# Altium schematic sheet WR_LINK.SchDoc
size A3 portrait
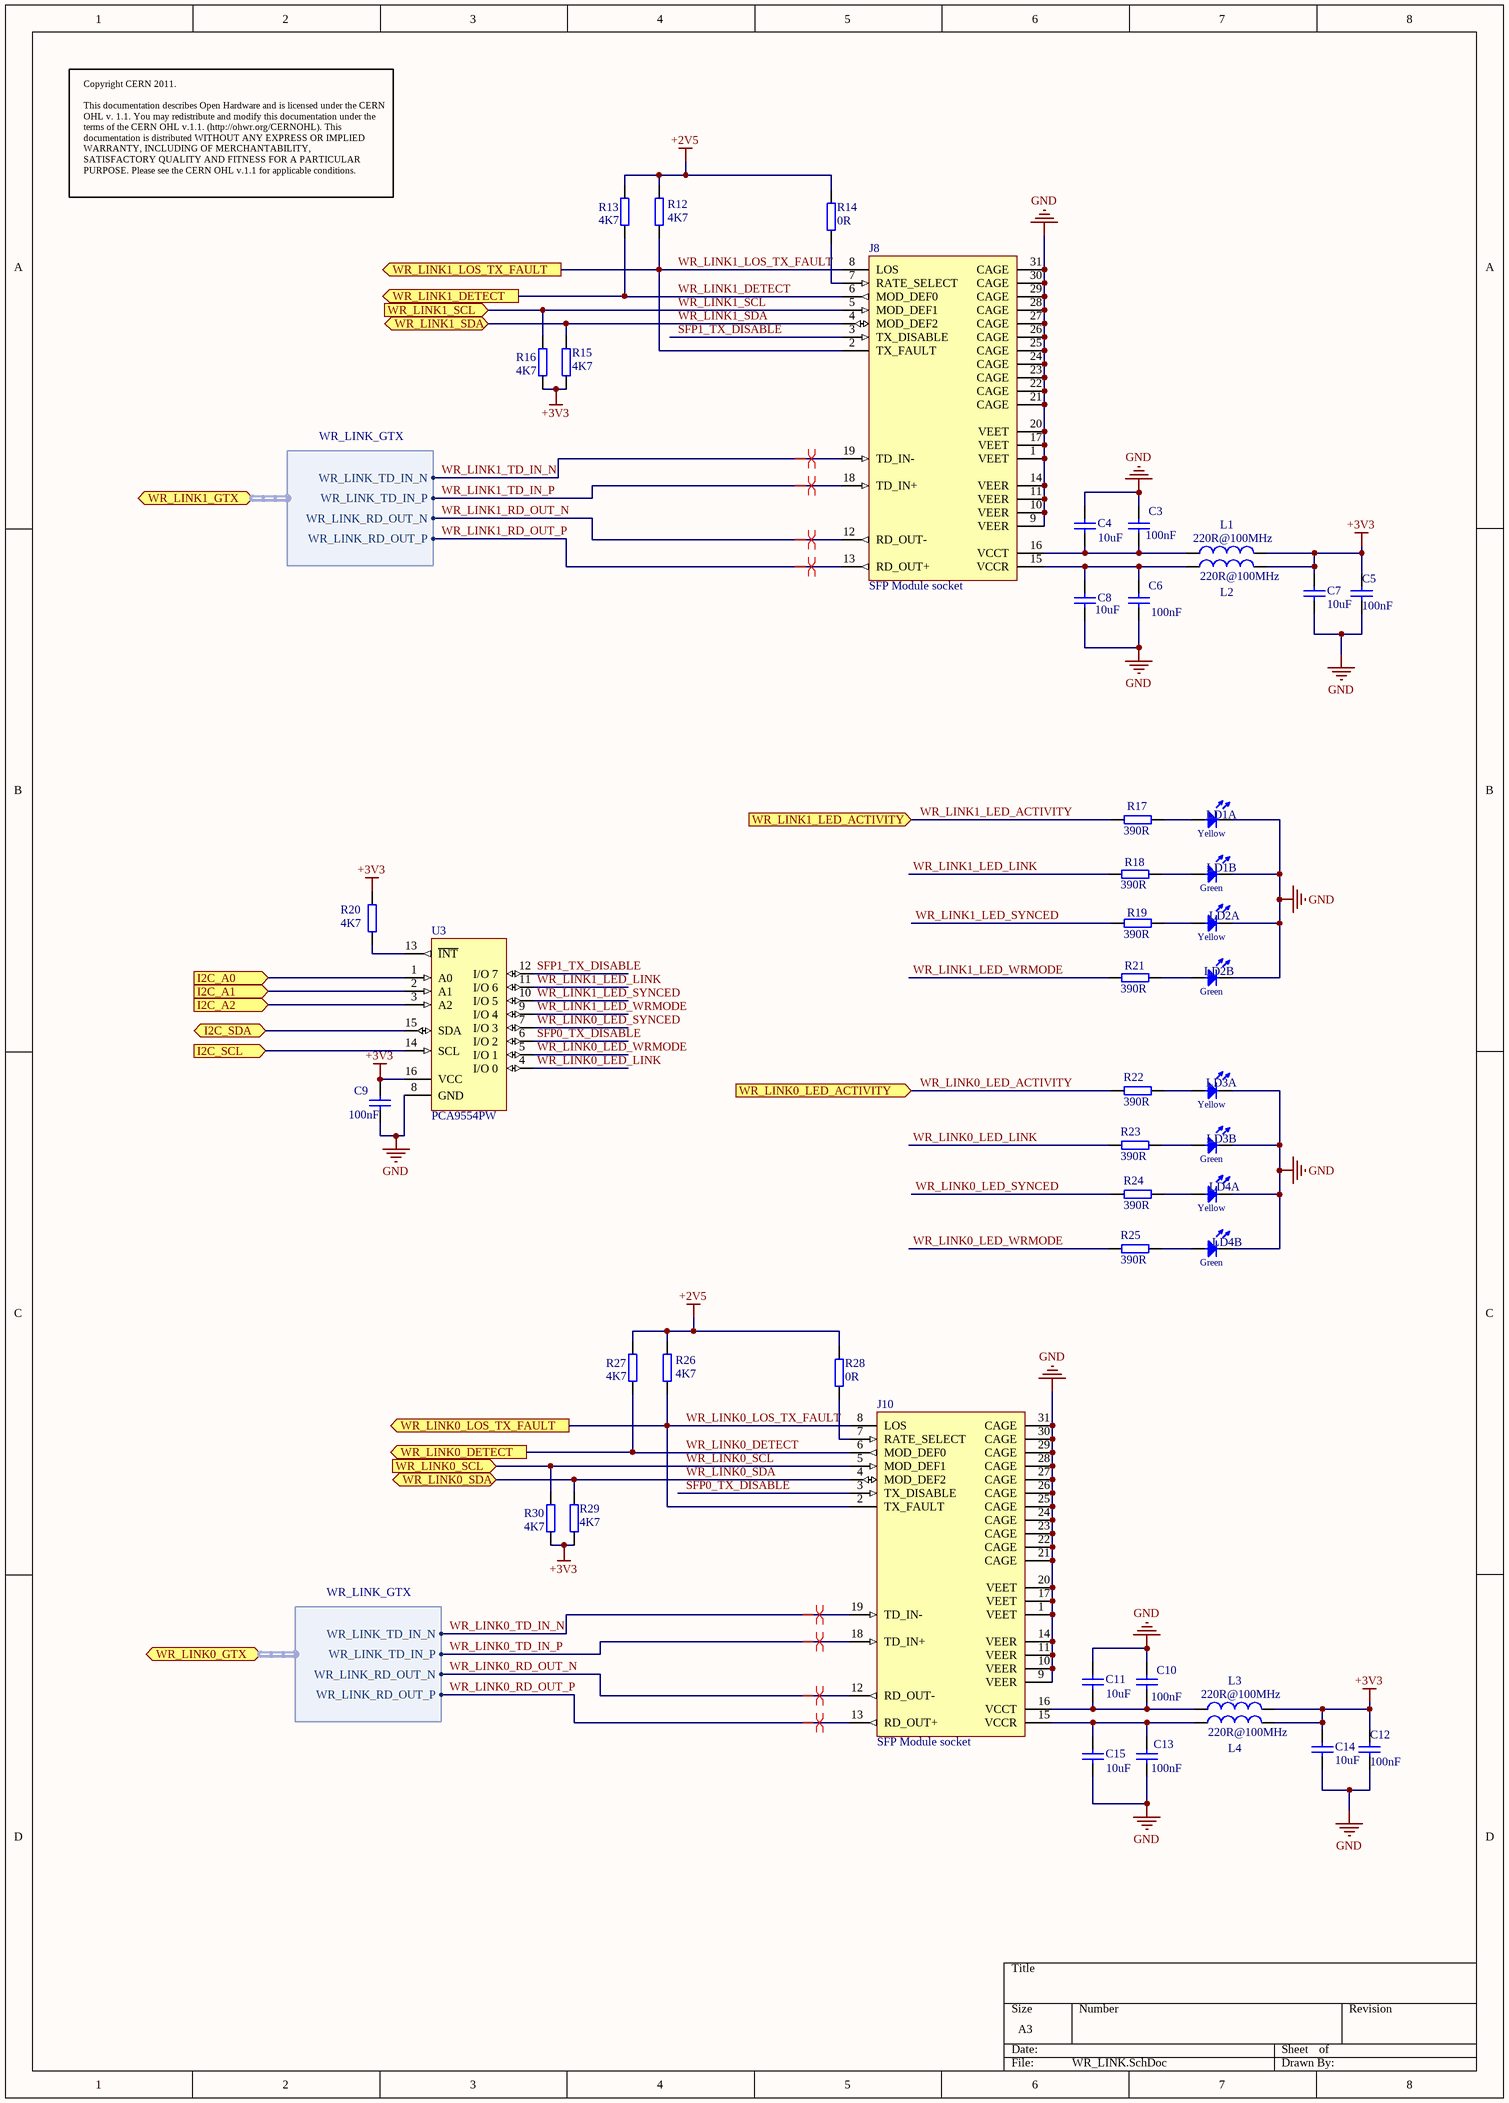
[diagram p0: WR_LINK.SchDoc]

## Parts
C3  100nF  [CC1608-0603]
C4  10uF  [CC2012-0805]
C5  100nF  [CC1608-0603]
C6  100nF  [CC1608-0603]
C7  10uF  [CC1608-0603]
C8  10uF  [CC2012-0805]
C9  100nF  [CC1608-0603]
C10  100nF  [CC1608-0603]
C11  10uF  [CC2012-0805]
C12  100nF  [CC1608-0603]
C13  100nF  [CC1608-0603]
C14  10uF  [CC1608-0603]
C15  10uF  [CC2012-0805]
J8  SFP Module socket  [SFP_SINGLE_PORT]
J10  SFP Module socket  [SFP_SINGLE_PORT]
L1  Impedance: 220R@100MHz  [0603]  (hidden comment: 220R@100MHz Ferrite Bead)
L2  Impedance: 220R@100MHz  [0603]  (hidden comment: 220R@100MHz Ferrite Bead)
L3  Impedance: 220R@100MHz  [0603]  (hidden comment: 220R@100MHz Ferrite Bead)
L4  Impedance: 220R@100MHz  [0603]  (hidden comment: 220R@100MHz Ferrite Bead)
LD1  Green/Yellow  [LED_DIALIGHT_591-3x0x-0xx]  (value not drawn)  (parts A,B of 2)
LD2  Green/Yellow  [LED_DIALIGHT_591-3x0x-0xx]  (value not drawn)  (parts A,B of 2)
LD3  Green/Yellow  [LED_DIALIGHT_591-3x0x-0xx]  (value not drawn)  (parts A,B of 2)
LD4  Green/Yellow  [LED_DIALIGHT_591-3x0x-0xx]  (value not drawn)  (parts A,B of 2)
R12  4K7  [0603]
R13  4K7  [0603]
R14  0R  [0603]
R15  4K7  [0603]
R16  4K7  [0603]
R17  390R  [0603]
R18  390R  [0603]
R19  390R  [0603]
R20  4K7  [0603]
R21  390R  [0603]
R22  390R  [0603]
R23  390R  [0603]
R24  390R  [0603]
R25  390R  [0603]
R26  4K7  [0603]
R27  4K7  [0603]
R28  0R  [0603]
R29  4K7  [0603]
R30  4K7  [0603]
U3  PCA9554PW  [SOP65P640X120-16N]

## Ports
I2C_A0 (in), I2C_A1 (in), I2C_A2 (in), I2C_SCL (in), I2C_SDA (bidir), WR_LINK0_DETECT (out), WR_LINK0_GTX (harness WR_LINK_GTX), WR_LINK0_LED_ACTIVITY (in), WR_LINK0_LOS_TX_FAULT (out), WR_LINK0_SCL (in), WR_LINK0_SDA (bidir), WR_LINK1_DETECT (out), WR_LINK1_GTX (harness WR_LINK_GTX), WR_LINK1_LED_ACTIVITY (in), WR_LINK1_LOS_TX_FAULT (out), WR_LINK1_SCL (in), WR_LINK1_SDA (bidir)

## Harnesses
WR_LINK_GTX: WR_LINK_TD_IN_N, WR_LINK_TD_IN_P, WR_LINK_RD_OUT_N, WR_LINK_RD_OUT_P

## Nets
+2V5: R12.2 R13.2 R14.1 R26.2 R27.2 R28.1
+3V3: C5.1 C7.1 C9.1 C12.1 C14.1 L1.2 L2.2 L3.2 L4.2 R15.2 R16.2 R20.2 R29.2 R30.2 U3.16(VCC)
GND: C3.1 C4.2 C5.2 C6.2 C7.2 C8.1 C9.2 C10.1 C11.2 C12.2 C13.2 C14.2 C15.1 J8.1(VEET) J8.9(VEER) J8.10(VEER) J8.11(VEER) J8.14(VEER) J8.17(VEET) J8.20(VEET) J8.21(CAGE) J8.22(CAGE) J8.23(CAGE) J8.24(CAGE) J8.25(CAGE) J8.26(CAGE) J8.27(CAGE) J8.28(CAGE) J8.29(CAGE) J8.30(CAGE) J8.31(CAGE) J10.1(VEET) J10.9(VEER) J10.10(VEER) J10.11(VEER) J10.14(VEER) J10.17(VEET) J10.20(VEET) J10.21(CAGE) J10.22(CAGE) J10.23(CAGE) J10.24(CAGE) J10.25(CAGE) J10.26(CAGE) J10.27(CAGE) J10.28(CAGE) J10.29(CAGE) J10.30(CAGE) J10.31(CAGE) LD1.1(C) LD1.4(C) LD2.1(C) LD2.4(C) LD3.1(C) LD3.4(C) LD4.1(C) LD4.4(C) U3.8(GND)
I2C_A0: U3.1(A0) ; port I2C_A0
I2C_A1: U3.2(A1) ; port I2C_A1
I2C_A2: U3.3(A2) ; port I2C_A2
I2C_SCL: U3.14(SCL) ; port I2C_SCL
I2C_SDA: U3.15(SDA) ; port I2C_SDA
SFP0_TX_DISABLE: J10.3(TX_DISABLE) U3.6(I/O_2)
SFP1_TX_DISABLE: J8.3(TX_DISABLE) U3.12(I/O_7)
WR_LINK0_DETECT: J10.6(MOD_DEF0) R27.1 ; port WR_LINK0_DETECT
WR_LINK0_LED_ACTIVITY: R22.2 ; port WR_LINK0_LED_ACTIVITY
WR_LINK0_LED_LINK: R23.2 U3.4(I/O_0)
WR_LINK0_LED_SYNCED: R24.2 U3.7(I/O_3)
WR_LINK0_LED_WRMODE: R25.2 U3.5(I/O_1)
WR_LINK0_LOS_TX_FAULT: J10.2(TX_FAULT) J10.8(LOS) R26.1 ; port WR_LINK0_LOS_TX_FAULT
WR_LINK0_RD_OUT_N: J10.12(RD_OUT-) ; port WR_LINK0_GTX.WR_LINK_RD_OUT_N
WR_LINK0_RD_OUT_P: J10.13(RD_OUT+) ; port WR_LINK0_GTX.WR_LINK_RD_OUT_P
WR_LINK0_SCL: J10.5(MOD_DEF1) R30.1 ; port WR_LINK0_SCL
WR_LINK0_SDA: J10.4(MOD_DEF2) R29.1 ; port WR_LINK0_SDA
WR_LINK0_TD_IN_N: J10.19(TD_IN-) ; port WR_LINK0_GTX.WR_LINK_TD_IN_N
WR_LINK0_TD_IN_P: J10.18(TD_IN+) ; port WR_LINK0_GTX.WR_LINK_TD_IN_P
WR_LINK1_DETECT: J8.6(MOD_DEF0) R13.1 ; port WR_LINK1_DETECT
WR_LINK1_LED_ACTIVITY: R17.2 ; port WR_LINK1_LED_ACTIVITY
WR_LINK1_LED_LINK: R18.2 U3.11(I/O_6)
WR_LINK1_LED_SYNCED: R19.2 U3.10(I/O_5)
WR_LINK1_LED_WRMODE: R21.2 U3.9(I/O_4)
WR_LINK1_LOS_TX_FAULT: J8.2(TX_FAULT) J8.8(LOS) R12.1 ; port WR_LINK1_LOS_TX_FAULT
WR_LINK1_RD_OUT_N: J8.12(RD_OUT-) ; port WR_LINK1_GTX.WR_LINK_RD_OUT_N
WR_LINK1_RD_OUT_P: J8.13(RD_OUT+) ; port WR_LINK1_GTX.WR_LINK_RD_OUT_P
WR_LINK1_SCL: J8.5(MOD_DEF1) R16.1 ; port WR_LINK1_SCL
WR_LINK1_SDA: J8.4(MOD_DEF2) R15.1 ; port WR_LINK1_SDA
WR_LINK1_TD_IN_N: J8.19(TD_IN-) ; port WR_LINK1_GTX.WR_LINK_TD_IN_N
WR_LINK1_TD_IN_P: J8.18(TD_IN+) ; port WR_LINK1_GTX.WR_LINK_TD_IN_P
NetC3_2: C3.2 C4.1 J8.16(VCCT) L1.1
NetC6_1: C6.1 C8.2 J8.15(VCCR) L2.1
NetC10_2: C10.2 C11.1 J10.16(VCCT) L3.1
NetC13_1: C13.1 C15.2 J10.15(VCCR) L4.1
NetJ8_7: J8.7(RATE_SELECT) R14.2
NetJ10_7: J10.7(RATE_SELECT) R28.2
NetLD1_2: LD1.2(A) R17.1
NetLD1_3: LD1.3(A) R18.1
NetLD2_2: LD2.2(A) R19.1
NetLD2_3: LD2.3(A) R21.1
NetLD3_2: LD3.2(A) R22.1
NetLD3_3: LD3.3(A) R23.1
NetLD4_2: LD4.2(A) R24.1
NetLD4_3: LD4.3(A) R25.1
NetR20_1: R20.1 U3.13(~{INT})

## Layout directives
differential pair: WR_LINK0_RD_OUT_N, WR_LINK0_RD_OUT_P, WR_LINK0_TD_IN_N, WR_LINK0_TD_IN_P, WR_LINK1_RD_OUT_N, WR_LINK1_RD_OUT_P, WR_LINK1_TD_IN_N, WR_LINK1_TD_IN_P

## Notes on the sheet
- Copyright CERN 2011.
  This documentation describes Open Hardware and is licensed under the CERN OHL v. 1.1. You may redistribute and modify this documentation under the terms of the CERN OHL v.1.1. (http://ohwr.org/CERNOHL). This documentation is distributed WITHOUT ANY EXPRESS OR IMPLIED WARRANTY, INCLUDING OF MERCHANTABILITY, SATISFACTORY QUALITY AND FITNESS FOR A PARTICULAR PURPOSE. Please see the CERN OHL v.1.1 for applicable conditions.
- (in symbol LED_DIALIGHT_591-3x0x, part A) Yellow
- (in symbol LED_DIALIGHT_591-3x0x, part B) Green

## Library data of the parts
C3 C5 C6 C9 C10 C12 C13 = CC0603_100NF_16V_10%_X7R: Capacitor; Manufacturer1: AVX; Manufacturer1 PN: 0603YC104KAT2A; TC: X7R; Tolerance: ±10%; Voltage: 16V; Published: 8-Jun-2000; LatestRevisionDate: 17-Jul-2002; LatestRevisionNote: Re-released for DXP Platform.; PackageReference: RAD-0.3; Publisher: Altium Limited; Distributor1: Digikey; Distributor1 PN: 478-1239-1-ND; Case: 0603; Value: 100nF
C4 C8 C11 C15 = CC0805_10UF_16V_10%_X5R: Capacitor; Manufacturer1: Murata; Manufacturer1 PN: GRM21BR61A106KE19L; TC: X5R; Tolerance: ±10%; Voltage: 16V; Published: 8-Jun-2000; LatestRevisionDate: 17-Jul-2002; LatestRevisionNote: Re-released for DXP Platform.; PackageReference: RAD-0.3; Publisher: Altium Limited; Distributor1: Digikey; Distributor1 PN: 490-1709-1-ND; Case: 0805; Value: 10uF
C7 C14 = CC0603_10UF_6.3V_20%_X5R: Capacitor; Manufacturer1: TDK; Manufacturer1 PN: C1608X5R0J106M; TC: X5R; Tolerance: ±20%; Voltage: 6.3V; Published: 8-Jun-2000; LatestRevisionDate: 17-Jul-2002; LatestRevisionNote: Re-released for DXP Platform.; PackageReference: RAD-0.3; Publisher: Altium Limited; Distributor1: Digikey; Distributor1 PN: 445-4112-1-ND; Case: 0603; Value: 10uF
J8 J10 = SFP_SOCKET_SINGLE: Socket for SFP module; Manufacturer1 PN: UE75A203000T; Manufacturer1: Amphenol; Distributor1 PN: 1256176; Distributor1: Farnell
L1-L4 = L_FERRITE_BEAD: ferrite bead; Manufacturer1: Murata; Manufacturer1 PN: BLM18KG221SN1D; Current Rating: 2.2A; DCR: 50mOhm; Case: 0603; Distributor1: Digikey; Distributor1 PN: 490-5255-1-ND
LD1-LD4 = LED_DIALIGHT_591-3x0x: Bi-Color LED SMD; Manufacturer1 PN: 591-3101-013F; Color: Green/Yellow; Footprint: LED_DIALIGHT_571-0132F; Manufacturer1: DIALIGHT; ComponentHeight: 5mm; Distributor1: Digikey; Distributor1 PN: 350-1790-1-ND
R12 R13 R15 R16 R20 R26 R27 R29 R30 = R0603_4.7K_±1%_0.1W_100PPM: SMD Resistor; Manufacturer1: Panasonic; Manufacturer1 PN: ERJ-3EKF4701V; TCR: 100ppm; Power Rating: 0.1W; Tolerance: ±1%; Case: 0603; Distributor1: DigiKey; Distributor1 PN: P4.70KHCT-ND; Value: 4K7
R14 R28 = R0603_0R_0.1W_JUMPER: SMD Resistor; Manufacturer1: Yageo; Manufacturer1 PN: RC0603JR-070RL; TCR: 200ppm; Power Rating: 0.1W; Case: 0603; Distributor1: DigiKey; Distributor1 PN: 311-0.0GRCT-ND; Tolerance: -; Value: 0R
R17-R19 R21-R25 = R0603_390R_±1%_0.1W_100PPM: SMD Resistor; Manufacturer1: Panasonic; Manufacturer1 PN: ERJ-3EKF3900V; TCR: 100ppm; Power Rating: 0.1W; Tolerance: ±1%; Case: 0603; Distributor1: DigiKey; Distributor1 PN: P390HCT-ND; Value: 390R
U3 = PCA9554D: 8-bit I2C-bus SMBus I/O port with interrupt; Manufacturer1 PN: PCA9554PW,112; Manufacturer1: NXP Semiconductors; Distributor1: Digikey; Distributor1 PN: 568-3984-5-ND